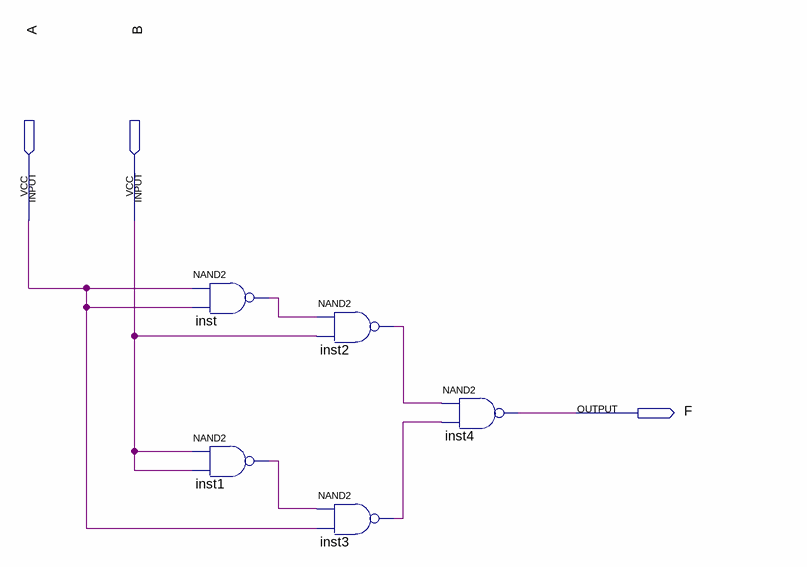
[diagram p0: schematic sheet]
// Quartus schematic Block1.bdf as structural Verilog: 5 symbols, 3 pins
module Block1 (
  input  A,
  input  B,
  output F
);

  wire inst1_out, inst2_out, inst3_out, inst_out;

  nand inst (inst_out, A, A);
  nand inst1 (inst1_out, B, B);
  nand inst2 (inst2_out, inst_out, B);
  nand inst3 (inst3_out, inst1_out, A);
  nand inst4 (F, inst2_out, inst3_out);
endmodule
